# EAGLE schematic ARM_esquemático (EAGLE 6.6.0)
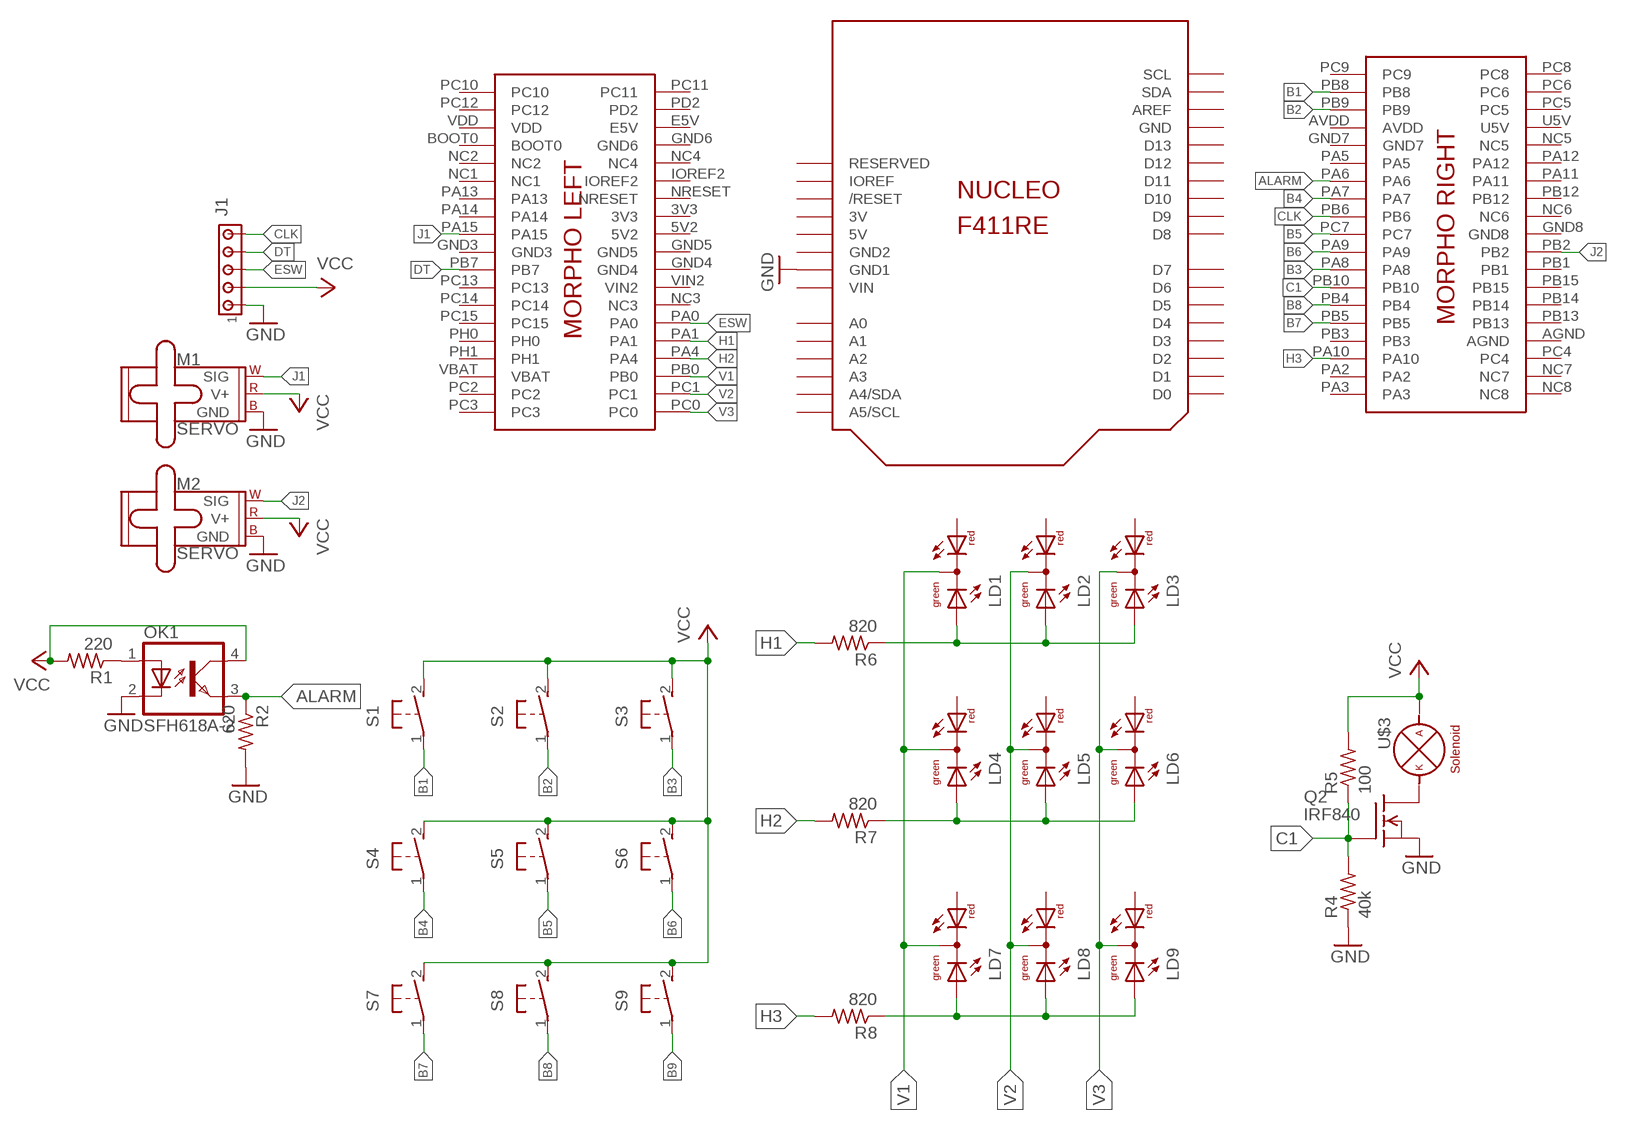
[diagram p0: schematic, sheet 1]

## Parts
J1  MTA05-100  [10X05MTA]
LD1  DUOLED-RG-C  [DUOLED-C-5MM]
LD2  DUOLED-RG-C  [DUOLED-C-5MM]
LD3  DUOLED-RG-C  [DUOLED-C-5MM]
LD4  DUOLED-RG-C  [DUOLED-C-5MM]
LD5  DUOLED-RG-C  [DUOLED-C-5MM]
LD6  DUOLED-RG-C  [DUOLED-C-5MM]
LD7  DUOLED-RG-C  [DUOLED-C-5MM]
LD8  DUOLED-RG-C  [DUOLED-C-5MM]
LD9  DUOLED-RG-C  [DUOLED-C-5MM]
M1  SERVO  [1X03]
M2  SERVO  [1X03]
OK1  SFH618A-2  [DIP4]
Q2  IRF840  [TO220]
R1  220  R-US_0204/7  [0204/7]
R2  620  R-US_0204/7  [0204/7]
R4  40k  R-US_0204/7  [0204/7]
R5  100  R-US_0204/7  [0204/7]
R6  820  R-US_0204/7  [0204/7]
R7  820  R-US_0204/7  [0204/7]
R8  820  R-US_0204/7  [0204/7]
S1  31-XX  [B3F-31XX]
S2  31-XX  [B3F-31XX]
S3  31-XX  [B3F-31XX]
S4  31-XX  [B3F-31XX]
S5  31-XX  [B3F-31XX]
S6  31-XX  [B3F-31XX]
S7  31-XX  [B3F-31XX]
S8  31-XX  [B3F-31XX]
S9  31-XX  [B3F-31XX]
U$1  NUCLEO_F411RE  [NUCLEO_BRD64]
U$3  -MOTOR  [CON2]

## Nets
ALARM: OK1.3(EMIT) R2.1 U$1.PA6
B1: S1.1(P) U$1.PB8
B2: S2.1(P) U$1.PB9
B3: S3.1(P) U$1.PA8
B4: S4.1(P) U$1.PA7
B5: S5.1(P) U$1.PC7
B6: S6.1(P) U$1.PA9
B7: S7.1(P) U$1.PB5
B8: S8.1(P) U$1.PB4
B9: S9.1(P)
C1: Q2.1(G) R4.2 R5.1 U$1.PB10
CLK: J1.5 U$1.PB6
DT: J1.4 U$1.PB7
ESW: J1.3 U$1.PA0
GND: J1.1 M1.3(GND) M2.3(GND) OK1.2(C) Q2.3(S) R2.2 R4.1 U$1.GND1
H1: R6.2 U$1.PA1
H2: R7.2 U$1.PA4
H3: R8.2 U$1.PA10
J1: M1.1(SIG) U$1.PA15
J2: M2.1(SIG) U$1.PB2
N$1: OK1.1(A) R1.1
N$6: Q2.2(D) U$3.P$2(-)
N$9: LD1.AX(AG) LD2.AX(AG) LD3.AX(AG) R6.1
N$10: LD4.AX(AG) LD5.AX(AG) LD6.AX(AG) R7.1
N$11: LD7.AX(AG) LD8.AX(AG) LD9.AX(AG) R8.1
V1: LD1.C LD4.C LD7.C U$1.PB0
V2: LD2.C LD5.C LD8.C U$1.PC1
V3: LD3.C LD6.C LD9.C U$1.PC0
VCC: J1.2 M1.2(V+) M2.2(V+) OK1.4(COL) R1.2 R5.2 S1.2(S) S2.2(S) S3.2(S) S4.2(S) S5.2(S) S6.2(S) S7.2(S) S8.2(S) S9.2(S) U$3.P$1(+)
Unconnected: LD1.AR LD2.AR LD3.AR LD4.AR LD5.AR LD6.AR LD7.AR LD8.AR LD9.AR U$1.A0 U$1.A1 U$1.A2 U$1.A3 U$1.A4(A4/SDA) U$1.A5(A5/SCL) U$1.AREF U$1.BOOT0 U$1.D0 U$1.D1 U$1.D2 U$1.D3 U$1.D4 U$1.D5 U$1.D6 U$1.D7 U$1.D8 U$1.D9 U$1.D10 U$1.D11 U$1.D12 U$1.D13 U$1.IOREF U$1.IOREF2 U$1.NC1 U$1.NC2 U$1.NC3 U$1.NC4 U$1.NC5 U$1.NC6 U$1.NC7 U$1.NC8 U$1.NRESET U$1.PA2 U$1.PA3 U$1.PA5 U$1.PA11 U$1.PA12 U$1.PA13 U$1.PA14 U$1.PB1 U$1.PB3 U$1.PB12 U$1.PB13 U$1.PB14 U$1.PB15 U$1.PC2 U$1.PC3 U$1.PC4 U$1.PC5 U$1.PC6 U$1.PC8 U$1.PC9 U$1.PC10 U$1.PC11 U$1.PC12 U$1.PC13 U$1.PC14 U$1.PC15 U$1.PD2 U$1.PH0 U$1.PH1 U$1.RESERVED U$1.RESET(/RESET) U$1.SCL U$1.SDA

## Power pins joined to a net without a drawn wire
3V: U$1.3V
3V3: U$1.3V3
5V: U$1.5V
5V2: U$1.5V2
AGND: U$1.AGND
AVDD: U$1.AVDD
E5V: U$1.E5V
GND: U$1.GND
GND2: U$1.GND2
GND3: U$1.GND3
GND4: U$1.GND4
GND5: U$1.GND5
GND6: U$1.GND6
GND7: U$1.GND7
GND8: U$1.GND8
U5V: U$1.U5V
VBAT: U$1.VBAT
VDD: U$1.VDD
VIN: U$1.VIN
VIN2: U$1.VIN2

## Library data of the parts
J1 = con-amp:MTA05-100: AMP connector
LD1-LD9 = led:DUOLED-RG-C: DUO LED 2 colors (red/green), 5 mm, round, common Cathode www.ligitek.com or other producers.
M1 M2 = SparkFun-Electromechanical:SERVO: Servo Motor 3-pin connector for a standard servo motor (voltage supply, ground, and control signal.) SparkFun Products Servo - Generic (Sub-Micro Size) <https://www.sparkfun.com/products/9065> (ROB-09065) Servo - Generic High Torque Continuous Rotation (Standard Size) <https://www.sparkfun.com/products/9347> (ROB-09347) Servo - Generic High Torque (Standard Size) <https://www.sparkfun.com/products/11965> (ROB-11965)
OK1 = optocoupler:SFH618?*: Optocoupler, Phototransistor Output, Low Input Current Source: Data sheet <http://www.vishay.com/docs/83673/sfh618.pdf>; MF: VISHAY/TELEFUNKEN; MPN: SFH618A-2; OC_FARNELL: 6424855; OC_NEWARK: 21H7744
Q2 = transistor-fet:IRF840: N-Channel Enhancement MOSFET (HEXFET); 500V; 8A; 0,85Ohm
R1 R2 R4-R8 = adafruit:R-US_: RESISTOR, American symbol
S1-S9 = adafruit:31-XX: OMRON SWITCH Now with beefier pads!
U$1 = Stm32nucleo:NUCLEO_F411RE
U$3 = tango:-MOTOR